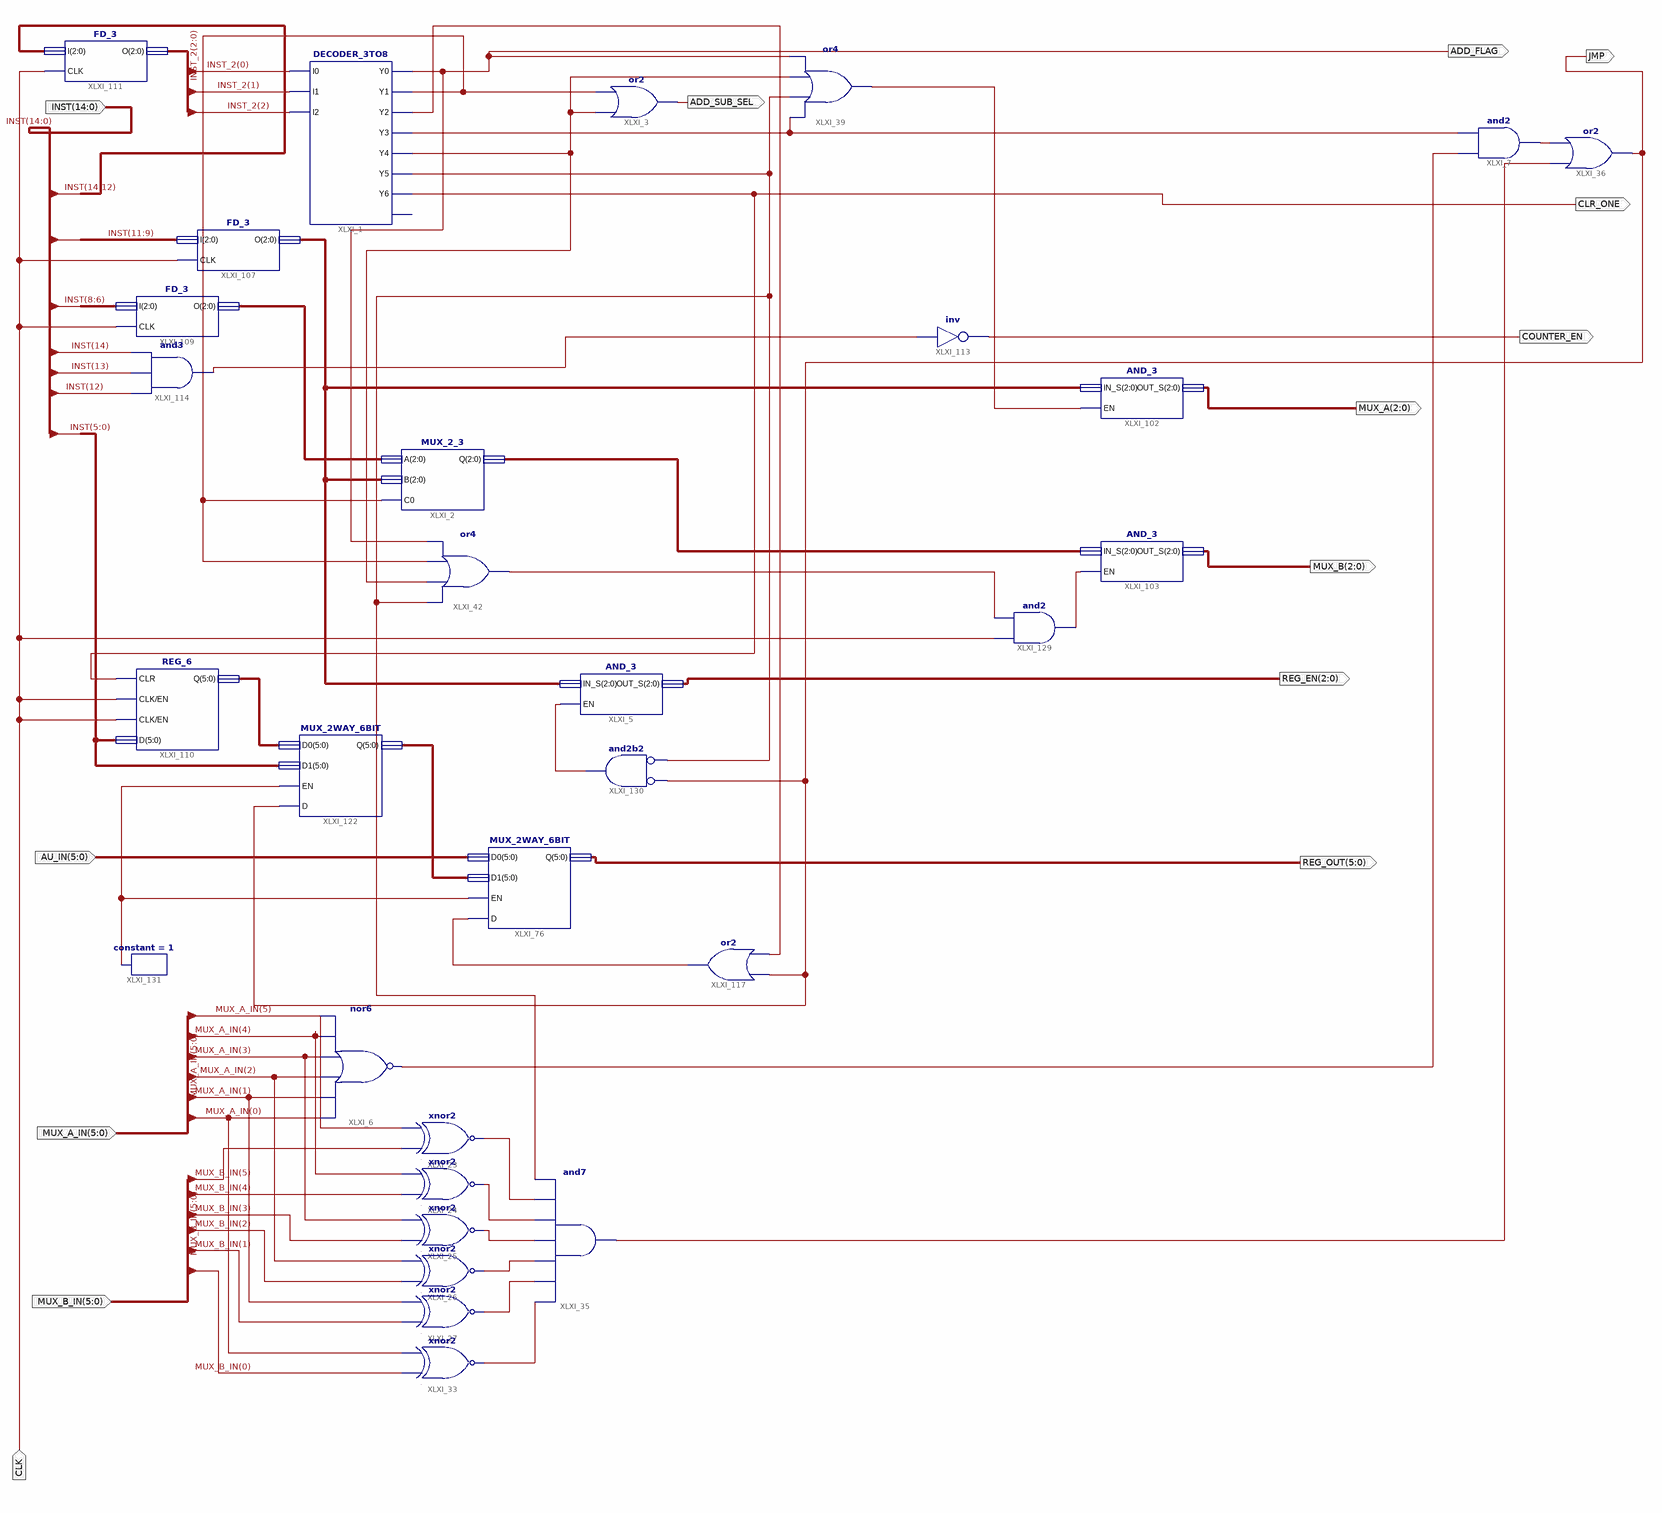
[diagram p0: schematic sheet 1]
// Xilinx ISE schematic INS_DEC_2.sch (spartan3e) as structural Verilog: 30 symbols, 14 ports
module INS_DEC_2 (
  input  [14:0] INST,
  input  [5:0] MUX_A_IN,
  input  [5:0] MUX_B_IN,
  input  [5:0] AU_IN,
  input  CLK,
  output ADD_FLAG,
  output ADD_SUB_SEL,
  output CLR_ONE,
  output COUNTER_EN,
  output [2:0] REG_EN,
  output [5:0] REG_OUT,
  output [2:0] MUX_A,
  output [2:0] MUX_B,
  output JMP
);

  wire XLXN_37, XLXN_78, XLXN_92, XLXN_93, XLXN_95, XLXN_96, XLXN_97, XLXN_99, XLXN_101, XLXN_102, XLXN_104,
       XLXN_226, XLXN_231, XLXN_233, XLXN_276, XLXN_278, XLXN_279, XLXN_285, XLXN_311, XLXN_312, XLXN_313;
  wire [2:0] INST_2, MUX_B_1, XLXN_257;
  wire [5:0] XLXN_293, XLXN_296;
  wire [11:9] INST_1;

  DECODER_3TO8 XLXI_1 (
    .I0(INST_2[0]), .I1(INST_2[1]), .I2(INST_2[2]), .Y0(ADD_FLAG), .Y1(XLXN_233), .Y2(XLXN_279),
    .Y3(XLXN_37), .Y4(XLXN_231), .Y5(XLXN_226), .Y6(CLR_ONE));  // open: Y7
  MUX_2_3 XLXI_2 (.A(XLXN_257), .B(INST_1), .C0(XLXN_233), .Q(MUX_B_1));
  or XLXI_3 (ADD_SUB_SEL, XLXN_231, XLXN_233);
  AND_3 XLXI_5 (.EN(XLXN_311), .IN_S(INST_1), .OUT_S(REG_EN));
  or XLXI_39 (XLXN_104, XLXN_37, XLXN_226, XLXN_231, ADD_FLAG);
  or XLXI_42 (XLXN_313, XLXN_226, XLXN_231, XLXN_233, ADD_FLAG);
  nor XLXI_6 (XLXN_78, MUX_A_IN[0], MUX_A_IN[1], MUX_A_IN[2], MUX_A_IN[3], MUX_A_IN[4], MUX_A_IN[5]);
  xnor XLXI_23 (XLXN_99, MUX_B_IN[5], MUX_A_IN[5]);
  xnor XLXI_24 (XLXN_92, MUX_B_IN[4], MUX_A_IN[4]);
  xnor XLXI_25 (XLXN_93, MUX_B_IN[3], MUX_A_IN[3]);
  xnor XLXI_26 (XLXN_95, MUX_B_IN[2], MUX_A_IN[2]);
  xnor XLXI_27 (XLXN_96, MUX_B_IN[1], MUX_A_IN[1]);
  xnor XLXI_33 (XLXN_97, MUX_B_IN[0], MUX_A_IN[0]);
  and XLXI_35 (XLXN_102, XLXN_97, XLXN_96, XLXN_95, XLXN_93, XLXN_92, XLXN_99, XLXN_226);
  and XLXI_7 (XLXN_101, XLXN_78, XLXN_37);
  or XLXI_36 (JMP, XLXN_102, XLXN_101);
  MUX_2WAY_6BIT XLXI_76 (.D(XLXN_278), .D0(AU_IN), .D1(XLXN_296), .EN(XLXN_285), .Q(REG_OUT));
  AND_3 XLXI_102 (.EN(XLXN_104), .IN_S(INST_1), .OUT_S(MUX_A));
  AND_3 XLXI_103 (.EN(XLXN_312), .IN_S(MUX_B_1), .OUT_S(MUX_B));
  FD_3 XLXI_107 (.CLK(CLK), .I(INST[11:9]), .O(INST_1));
  FD_3 XLXI_109 (.CLK(CLK), .I(INST[8:6]), .O(XLXN_257));
  REG_6 XLXI_110 (.CLK(CLK), .CLR(CLR_ONE), .D(INST[5:0]), .EN(CLK), .Q(XLXN_293));
  FD_3 XLXI_111 (.CLK(CLK), .I(INST[14:12]), .O(INST_2));
  not XLXI_113 (COUNTER_EN, XLXN_276);
  and XLXI_114 (XLXN_276, INST[12], INST[13], INST[14]);
  MUX_2WAY_6BIT XLXI_122 (.D(JMP), .D0(XLXN_293), .D1(INST[5:0]), .EN(XLXN_285), .Q(XLXN_296));
  or XLXI_117 (XLXN_278, XLXN_279, JMP);
  and XLXI_129 (XLXN_312, CLK, XLXN_313);
  and XLXI_130 (XLXN_311, ~JMP, ~XLXN_226);  // and2b2
  constant #(.CValue("1")) XLXI_131 (.O(XLXN_285));
endmodule
